# Altium schematic sheet GateDrive_schem.SchDoc
size B
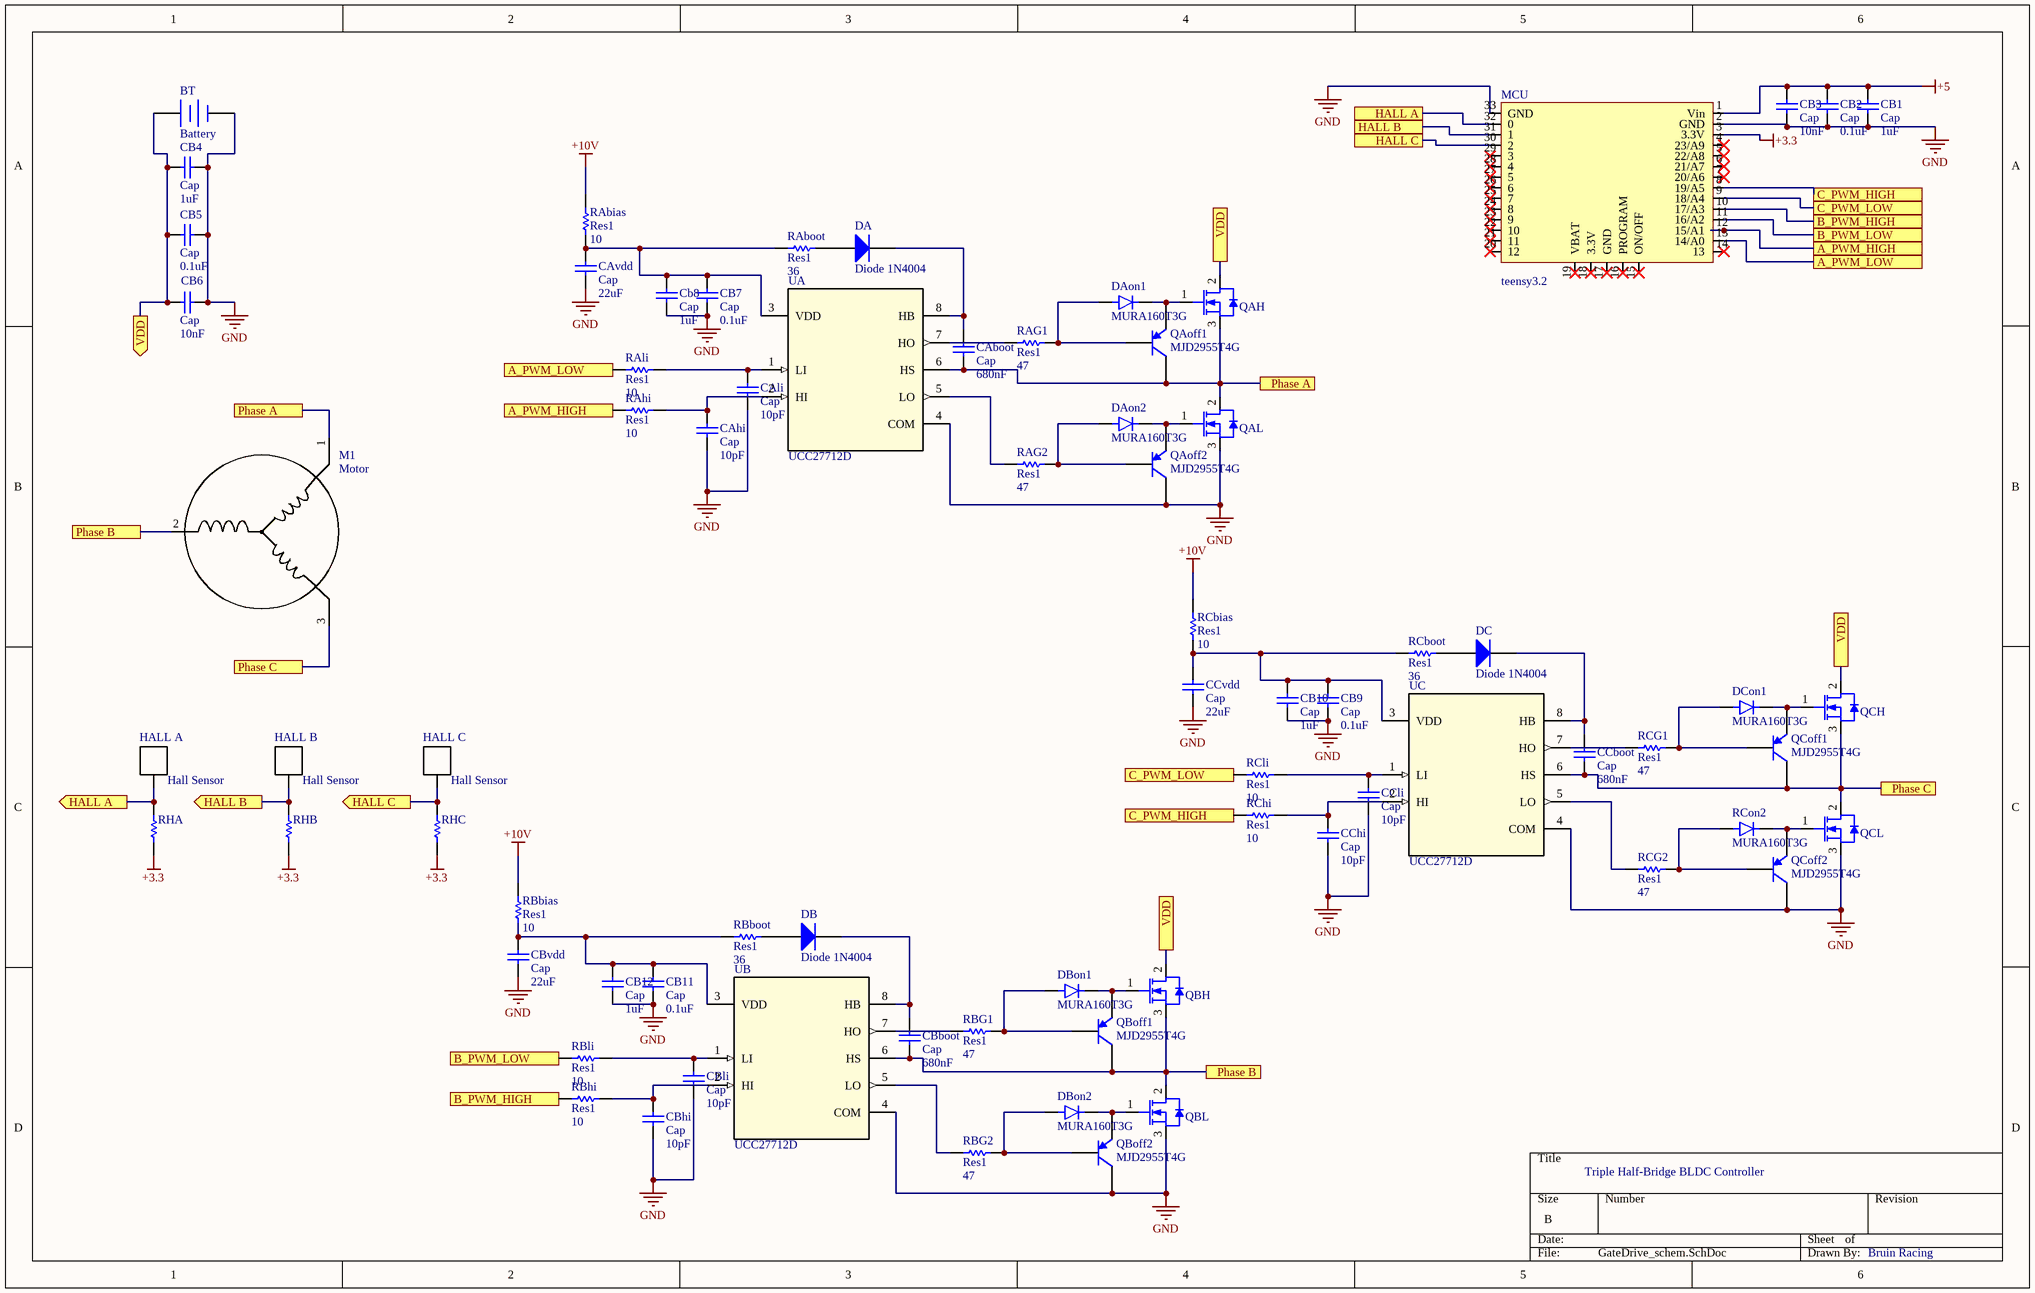
[diagram p0: GateDrive_schem.SchDoc]

## Parts
BT  Battery  [BAT-2]
CAboot  Cap  value 680nF  [RAD-0.3]
CAhi  Cap  value 10pF  [RAD-0.3]
CAli  Cap  value 10pF  [RAD-0.3]
CAvdd  Cap  value 22uF  [RAD-0.3]
CB1  Cap  value 1uF  [RAD-0.3]
CB2  Cap  value 0.1uF  [RAD-0.3]
CB3  Cap  value 10nF  [RAD-0.3]
CB4  Cap  value 1uF  [RAD-0.3]
CB5  Cap  value 0.1uF  [RAD-0.3]
CB6  Cap  value 10nF  [RAD-0.3]
CB7  Cap  value 0.1uF  [RAD-0.3]
Cb8  Cap  value 1uF  [RAD-0.3]
CB9  Cap  value 0.1uF  [RAD-0.3]
CB10  Cap  value 1uF  [RAD-0.3]
CB11  Cap  value 0.1uF  [RAD-0.3]
CB12  Cap  value 1uF  [RAD-0.3]
CBboot  Cap  value 680nF  [RAD-0.3]
CBhi  Cap  value 10pF  [RAD-0.3]
CBli  Cap  value 10pF  [RAD-0.3]
CBvdd  Cap  value 22uF  [RAD-0.3]
CCboot  Cap  value 680nF  [RAD-0.3]
CChi  Cap  value 10pF  [RAD-0.3]
CCli  Cap  value 10pF  [RAD-0.3]
CCvdd  Cap  value 22uF  [RAD-0.3]
DA  Diode 1N4004  [DO-41]
DAon1  MURA160T3G  [DIOM5226X220N]
DAon2  MURA160T3G  [DIOM5226X220N]
DB  Diode 1N4004  [DO-41]
DBon1  MURA160T3G  [DIOM5226X220N]
DBon2  MURA160T3G  [DIOM5226X220N]
DC  Diode 1N4004  [DO-41]
DCon1  MURA160T3G  [DIOM5226X220N]
HALL_A  Hall Sensor  [A single pin]
HALL_B  Hall Sensor  [A single pin]
HALL_C  Hall Sensor  [A single pin]
M1  Motor  [Motor]
MCU  teensy3.2  [teensy3.2]
QAH  INFINEON  [MOSFET-2]  (value not drawn)
QAL  INFINEON  [MOSFET-2]  (value not drawn)
QAoff1  MJD2955T4G  [MJD2955T4G]
QAoff2  MJD2955T4G  [MJD2955T4G]
QBH  INFINEON  [MOSFET-2]  (value not drawn)
QBL  INFINEON  [MOSFET-2]  (value not drawn)
QBoff1  MJD2955T4G  [MJD2955T4G]
QBoff2  MJD2955T4G  [MJD2955T4G]
QCH  INFINEON  [MOSFET-2]  (value not drawn)
QCL  INFINEON  [MOSFET-2]  (value not drawn)
QCoff1  MJD2955T4G  [MJD2955T4G]
QCoff2  MJD2955T4G  [MJD2955T4G]
RAbias  Res1  value 10  [RESC2013X50X30LL20T20]
RAboot  Res1  value 36  [RESC2013X50X30LL20T20]
RAG1  Res1  value 47  [RESC2013X50X30LL20T20]
RAG2  Res1  value 47  [RESC2013X50X30LL20T20]
RAhi  Res1  value 10  [RESC2013X50X30LL20T20]
RAli  Res1  value 10  [RESC2013X50X30LL20T20]
RBbias  Res1  value 10  [RESC2013X50X30LL20T20]
RBboot  Res1  value 36  [RESC2013X50X30LL20T20]
RBG1  Res1  value 47  [RESC2013X50X30LL20T20]
RBG2  Res1  value 47  [RESC2013X50X30LL20T20]
RBhi  Res1  value 10  [RESC2013X50X30LL20T20]
RBli  Res1  value 10  [RESC2013X50X30LL20T20]
RCbias  Res1  value 10  [RESC2013X50X30LL20T20]
RCboot  Res1  value 36  [RESC2013X50X30LL20T20]
RCG1  Res1  value 47  [RESC2013X50X30LL20T20]
RCG2  Res1  value 47  [RESC2013X50X30LL20T20]
RChi  Res1  value 10  [RESC2013X50X30LL20T20]
RCli  Res1  value 10  [RESC2013X50X30LL20T20]
RCon2  MURA160T3G  [DIOM5226X220N]
RHA  CRCW08050000Z0EA  [RESC2013X50X30LL20T20]  (value not drawn)
RHB  CRCW08050000Z0EA  [RESC2013X50X30LL20T20]  (value not drawn)
RHC  CRCW08050000Z0EA  [RESC2013X50X30LL20T20]  (value not drawn)
UA  UCC27712D  [D0008A_N]
UB  UCC27712D  [D0008A_N]
UC  UCC27712D  [D0008A_N]

## Ports
A_PWM_HIGH, A_PWM_LOW, B_PWM_HIGH, B_PWM_LOW, C_PWM_HIGH, C_PWM_LOW, HALL A, HALL A (out), HALL B, HALL B (out), HALL C, HALL C (out), Phase A, Phase B, Phase C, VDD, VDD (out)

## Nets
+3.3: MCU.3(3.3V) RHA.1 RHB.1 RHC.1
+5: CB1.2 CB2.2 CB3.2 MCU.1(Vin)
+10V: RAbias.2 RBbias.2 RCbias.2
GND: BT.2(-) CAhi.1 CAli.1 CAvdd.1 CB1.1 CB2.1 CB3.1 CB4.2 CB5.1 CB6.1 CB7.1 Cb8.1 CB9.1 CB10.1 CB11.1 CB12.1 CBhi.1 CBli.1 CBvdd.1 CChi.1 CCli.1 CCvdd.1 MCU.2(GND) MCU.33(GND) QAL.3(S) QAoff2.1(C) QBL.3(S) QBoff2.1(C) QCL.3(S) QCoff2.1(C) UA.4(COM) UB.4(COM) UC.4(COM)
A_PWM_HIGH: MCU.12(15/A1) RAhi.1 ; port A_PWM_HIGH
A_PWM_LOW: MCU.13(14/A0) RAli.1 ; port A_PWM_LOW
B_PWM_HIGH: MCU.10(17/A3) RBhi.1 ; port B_PWM_HIGH
B_PWM_LOW: MCU.11(16/A2) RBli.1 ; port B_PWM_LOW
C_PWM_HIGH: MCU.8(19/A5) RChi.1 ; port C_PWM_HIGH
C_PWM_LOW: MCU.9(18/A4) RCli.1 ; port C_PWM_LOW
HALL A: HALL_A.0 MCU.32(0) RHA.2 ; port HALL A
HALL B: HALL_B.0 MCU.31(1) RHB.2 ; port HALL B
HALL C: HALL_C.0 MCU.30(2) RHC.2 ; port HALL C
Phase A: CAboot.1 M1.1(A) QAH.3(S) QAL.2(D) QAoff1.1(C) UA.6(HS) ; port Phase A
Phase B: CBboot.1 M1.2(B) QBH.3(S) QBL.2(D) QBoff1.1(C) UB.6(HS) ; port Phase B
Phase C: CCboot.1 M1.3(C) QCH.3(S) QCL.2(D) QCoff1.1(C) UC.6(HS) ; port Phase C
VDD: BT.1(+) CB4.1 CB5.2 CB6.2 QAH.2(D) QBH.2(D) QCH.2(D) ; port VDD
NetCAboot_2: CAboot.2 DA.2(K) UA.8(HB)
NetCAhi_2: CAhi.2 RAhi.2 UA.2(HI)
NetCAli_2: CAli.2 RAli.2 UA.1(LI)
NetCAvdd_2: CAvdd.2 CB7.2 Cb8.2 RAbias.1 RAboot.2 UA.3(VDD)
NetCB9_2: CB9.2 CB10.2 CCvdd.2 RCbias.1 RCboot.2 UC.3(VDD)
NetCB11_2: CB11.2 CB12.2 CBvdd.2 RBbias.1 RBboot.2 UB.3(VDD)
NetCBboot_2: CBboot.2 DB.2(K) UB.8(HB)
NetCBhi_2: CBhi.2 RBhi.2 UB.2(HI)
NetCBli_2: CBli.2 RBli.2 UB.1(LI)
NetCCboot_2: CCboot.2 DC.2(K) UC.8(HB)
NetCChi_2: CChi.2 RChi.2 UC.2(HI)
NetCCli_2: CCli.2 RCli.2 UC.1(LI)
NetDA_1: DA.1(A) RAboot.1
NetDAon1_A: DAon1.A QAoff1.2(B) RAG1.2
NetDAon1_C: DAon1.C(K) QAH.1(G) QAoff1.3(E)
NetDAon2_A: DAon2.A QAoff2.2(B) RAG2.2
NetDAon2_C: DAon2.C(K) QAL.1(G) QAoff2.3(E)
NetDB_1: DB.1(A) RBboot.1
NetDBon1_A: DBon1.A QBoff1.2(B) RBG1.2
NetDBon1_C: DBon1.C(K) QBH.1(G) QBoff1.3(E)
NetDBon2_A: DBon2.A QBoff2.2(B) RBG2.2
NetDBon2_C: DBon2.C(K) QBL.1(G) QBoff2.3(E)
NetDC_1: DC.1(A) RCboot.1
NetDCon1_A: DCon1.A QCoff1.2(B) RCG1.2
NetDCon1_C: DCon1.C(K) QCH.1(G) QCoff1.3(E)
NetQCL_1: QCL.1(G) QCoff2.3(E) RCon2.C(K)
NetQCoff2_2: QCoff2.2(B) RCG2.2 RCon2.A
NetRAG1_1: RAG1.1 UA.7(HO)
NetRAG2_1: RAG2.1 UA.5(LO)
NetRBG1_1: RBG1.1 UB.7(HO)
NetRBG2_1: RBG2.1 UB.5(LO)
NetRCG1_1: RCG1.1 UC.7(HO)
NetRCG2_1: RCG2.1 UC.5(LO)

Not connected (* = marked no-connect by the designer): MCU 4(23/A9)* 5(22/A8)* 6(21/A7)* 7(20/A6)* 14(13)* 15(ON/OFF)* 16(PROGRAM)* 17(GND)* 18(3.3V)* 19(VBAT)* 20(12)* 21(11)* 22(10)* 23(9)* 24(8)* 25(7)* 26(6)* 27(5)* 28(4)* 29(3)*

## Notes on the sheet
- Triple Half-Bridge BLDC Controller
- Bruin Racing

## Library data of the parts
BT = Battery: Multicell Battery; Published: 24-Mar-1999; LatestRevisionDate: 17-Jul-2002; LatestRevisionNote: Re-released for DXP Platform.; PackageReference: BAT-2; Publisher: Altium Limited; PackageDescription: Battery; 2 Leads
CAboot CAhi CAli CAvdd CB1-CB7 Cb8 CB9-CB12 CBboot CBhi CBli CBvdd CCboot CChi CCli CCvdd = Cap: Capacitor; Published: 8-Jun-2000; LatestRevisionDate: 17-Jul-2002; LatestRevisionNote: Re-released for DXP Platform.; PackageReference: RAD-0.3; Publisher: Altium Limited; PackageDescription: Radial Cap, Thru-Hole; 2 Leads; 0.3 in Pin Spacing
DA DB DC = Diode 1N4004: 1 Amp General Purpose Rectifier; Published: 8-Jun-2000; LatestRevisionDate: 17-Jul-2002; LatestRevisionNote: Re-released for DXP Platform.; DatasheetVersion: 1998; PackageVersion: Aug-1999; PackageReference: DO-41; Publisher: Altium Limited; PackageDescription: Diode, Axial; Body 5.2 x 2.7 mm (LxDia. max), Lead Dia. 0.86 mm (max); Code_JEDEC: DO-204-AL; ComponentLink1Description: Manufacturer Link; ComponentLink1URL: http://www.fairchildsemi.com/; ComponentLink2Description: Datasheet; ComponentLink2URL: http://www.fairchildsemi.com/ds/1N%2F1N4001.pdf
DAon1 DAon2 DBon1 DBon2 DCon1 RCon2 = MURA160T3G: Diode Standard 600V 1A Surface Mount SMA; MF: ON Semiconductor; Value: *; Availability: Unavailable; Package: DO-214 ON Semiconductor; SnapEDA_Link: https://www.snapeda.com/parts/MURA160T3G/ON%20Semiconductor/view-part/418078/?ref=snap; Price: None; MP: MURA160T3G
QAoff1 QAoff2 QBoff1 QBoff2 QCoff1 QCoff2 = PNP: PNP Bipolar Transistor; Published: 8-Jun-2000; LatestRevisionDate: 29-May-2009; LatestRevisionNote: IPC-7351 Footprint Added.; PackageVersion: Aug-1999; PackageReference: SOT-23B; Publisher: Altium Limited; PackageDescription: 3-Pin SOT-23 Package 0.95 mm Pitch, 2.4 mm Lead Span
RAbias RAboot RAG1 RAG2 RAhi RAli RBbias RBboot RBG1 RBG2 RBhi RBli RCbias RCboot RCG1 RCG2 RChi RCli = Res1: Resistor; Published: 8-Jun-2000; LatestRevisionDate: 17-Jul-2002; LatestRevisionNote: Re-released for DXP Platform.; PackageReference: AXIAL-0.3; Publisher: Altium Limited; PackageDescription: Axial Device, Thru-Hole; 2 Leads; 0.3 in Pin Spacing
RHA RHB RHC = CMP-2001-04896-1: Manufacturer: Vishay Dale; Part Number: CRCW08050000Z0EA
UA UB UC = UCC27712D: No Description Available; PartNumber: UCC27712DR; Manufacturer: Texas Instruments; RefDes: RefDes; Type: DEV; Value: Value; Copyright: Copyright (C) 2018 Accelerated Designs. All rights reserved